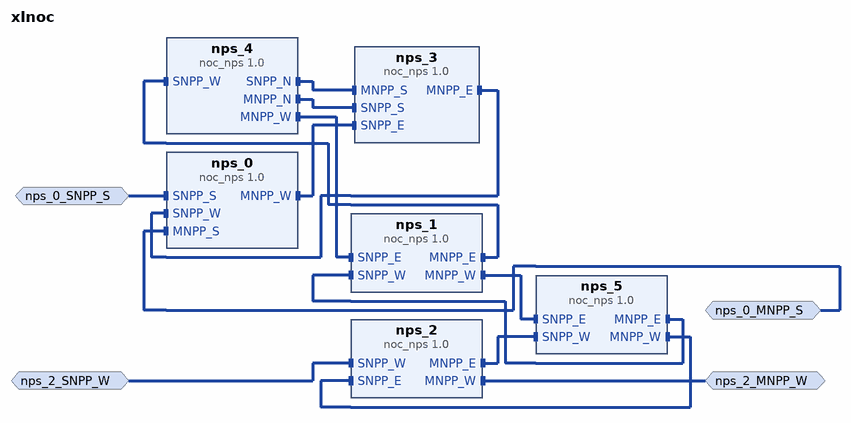
[diagram p0: block diagram of the top level]
# Vivado block design xlnoc, xcvm1802-vsva2197-2MP-e-S, Vivado 2022.2
create_bd_design xlnoc

create_bd_intf_port -mode Slave -vlnv xilinx.com:interface:npp_rtl:1.0 nps_0_SNPP_S
create_bd_intf_port -mode Master -vlnv xilinx.com:interface:npp_rtl:1.0 nps_2_MNPP_W
create_bd_intf_port -mode Slave -vlnv xilinx.com:interface:npp_rtl:1.0 nps_2_SNPP_W
create_bd_intf_port -mode Master -vlnv xilinx.com:interface:npp_rtl:1.0 nps_0_MNPP_S

create_bd_cell -type ip -vlnv xilinx.com:ip:noc_nps:1.0 nps_0
set_property -dict [list \
  CONFIG.USER_MEAST_PORT_EN FALSE \
  CONFIG.USER_MNORTH_PORT_EN FALSE \
  CONFIG.USER_SEAST_PORT_EN FALSE \
  CONFIG.USER_SNORTH_PORT_EN FALSE \
] [get_bd_cells nps_0]
create_bd_cell -type ip -vlnv xilinx.com:ip:noc_nps:1.0 nps_1
set_property -dict [list \
  CONFIG.USER_MNORTH_PORT_EN FALSE \
  CONFIG.USER_MSOUTH_PORT_EN FALSE \
  CONFIG.USER_SNORTH_PORT_EN FALSE \
  CONFIG.USER_SSOUTH_PORT_EN FALSE \
] [get_bd_cells nps_1]
create_bd_cell -type ip -vlnv xilinx.com:ip:noc_nps:1.0 nps_2
set_property -dict [list \
  CONFIG.USER_MNORTH_PORT_EN FALSE \
  CONFIG.USER_MSOUTH_PORT_EN FALSE \
  CONFIG.USER_SNORTH_PORT_EN FALSE \
  CONFIG.USER_SSOUTH_PORT_EN FALSE \
] [get_bd_cells nps_2]
create_bd_cell -type ip -vlnv xilinx.com:ip:noc_nps:1.0 nps_3
set_property -dict [list \
  CONFIG.USER_MNORTH_PORT_EN FALSE \
  CONFIG.USER_MWEST_PORT_EN FALSE \
  CONFIG.USER_SNORTH_PORT_EN FALSE \
  CONFIG.USER_SWEST_PORT_EN FALSE \
] [get_bd_cells nps_3]
create_bd_cell -type ip -vlnv xilinx.com:ip:noc_nps:1.0 nps_4
set_property -dict [list \
  CONFIG.USER_MEAST_PORT_EN FALSE \
  CONFIG.USER_MSOUTH_PORT_EN FALSE \
  CONFIG.USER_SEAST_PORT_EN FALSE \
  CONFIG.USER_SSOUTH_PORT_EN FALSE \
] [get_bd_cells nps_4]
create_bd_cell -type ip -vlnv xilinx.com:ip:noc_nps:1.0 nps_5
set_property -dict [list \
  CONFIG.USER_MNORTH_PORT_EN FALSE \
  CONFIG.USER_MSOUTH_PORT_EN FALSE \
  CONFIG.USER_SNORTH_PORT_EN FALSE \
  CONFIG.USER_SSOUTH_PORT_EN FALSE \
] [get_bd_cells nps_5]

# ---- connections ----

connect_bd_intf_net [get_bd_intf_ports nps_0_MNPP_S] [get_bd_intf_pins nps_0/MNPP_S]
connect_bd_intf_net [get_bd_intf_pins nps_0/MNPP_W] [get_bd_intf_pins nps_3/SNPP_E]
connect_bd_intf_net [get_bd_intf_ports nps_0_SNPP_S] [get_bd_intf_pins nps_0/SNPP_S]
connect_bd_intf_net [get_bd_intf_pins nps_1/MNPP_E] [get_bd_intf_pins nps_4/SNPP_W]
connect_bd_intf_net [get_bd_intf_pins nps_1/MNPP_W] [get_bd_intf_pins nps_5/SNPP_E]
connect_bd_intf_net [get_bd_intf_pins nps_2/MNPP_E] [get_bd_intf_pins nps_5/SNPP_W]
connect_bd_intf_net [get_bd_intf_ports nps_2_MNPP_W] [get_bd_intf_pins nps_2/MNPP_W]
connect_bd_intf_net [get_bd_intf_ports nps_2_SNPP_W] [get_bd_intf_pins nps_2/SNPP_W]
connect_bd_intf_net [get_bd_intf_pins nps_3/MNPP_E] [get_bd_intf_pins nps_0/SNPP_W]
connect_bd_intf_net [get_bd_intf_pins nps_3/MNPP_S] [get_bd_intf_pins nps_4/SNPP_N]
connect_bd_intf_net [get_bd_intf_pins nps_4/MNPP_N] [get_bd_intf_pins nps_3/SNPP_S]
connect_bd_intf_net [get_bd_intf_pins nps_4/MNPP_W] [get_bd_intf_pins nps_1/SNPP_E]
connect_bd_intf_net [get_bd_intf_pins nps_5/MNPP_E] [get_bd_intf_pins nps_1/SNPP_W]
connect_bd_intf_net [get_bd_intf_pins nps_5/MNPP_W] [get_bd_intf_pins nps_2/SNPP_E]

validate_bd_design
save_bd_design
